# EAGLE design psplcd (EAGLE 5.11)

## Sheet 1 of 2
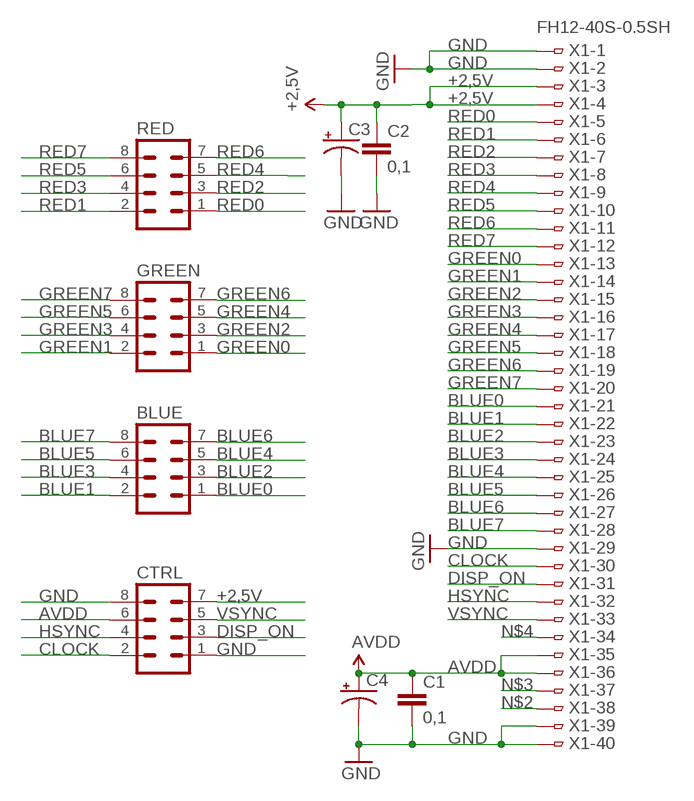
[diagram p0: schematic, sheet 1]

### Parts
BLUE  MA04-2  [MA04-2]
C1  0,1  CAP0603-CAP  [0603-CAP]
C2  0,1  CAP0603-CAP  [0603-CAP]
C3  CAP_POL3528  [EIA3528]
C4  CAP_POL3528  [EIA3528]
CTRL  MA04-2  [MA04-2]
GREEN  MA04-2  [MA04-2]
RED  MA04-2  [MA04-2]
X1  FH12-40S-0.5SH  [FH12-40S-0.5SH]

### Nets
+2,5V: C2.1 C3.A(+) CTRL.7 X1.3 X1.4
AVDD: C1.1 C4.A(+) CTRL.6 X1.35 X1.36
BLUE0: BLUE.1 X1.21
BLUE1: BLUE.2 X1.22
BLUE2: BLUE.3 X1.23
BLUE3: BLUE.4 X1.24
BLUE4: BLUE.5 X1.25
BLUE5: BLUE.6 X1.26
BLUE6: BLUE.7 X1.27
BLUE7: BLUE.8 X1.28
CLOCK: CTRL.2 X1.30
DISP_ON: CTRL.3 X1.31
GND: C1.2 C2.2 C3.C(-) C4.C(-) CTRL.1 CTRL.8 X1.1 X1.2 X1.29 X1.39 X1.40 ; also sheet 2
GREEN0: GREEN.1 X1.13
GREEN1: GREEN.2 X1.14
GREEN2: GREEN.3 X1.15
GREEN3: GREEN.4 X1.16
GREEN4: GREEN.5 X1.17
GREEN5: GREEN.6 X1.18
GREEN6: GREEN.7 X1.19
GREEN7: GREEN.8 X1.20
HSYNC: CTRL.4 X1.32
N$2: X1.38
N$3: X1.37
N$4: X1.34
RED0: RED.1 X1.5
RED1: RED.2 X1.6
RED2: RED.3 X1.7
RED3: RED.4 X1.8
RED4: RED.5 X1.9
RED5: RED.6 X1.10
RED6: RED.7 X1.11
RED7: RED.8 X1.12
VSYNC: CTRL.5 X1.33

## Sheet 2 of 2
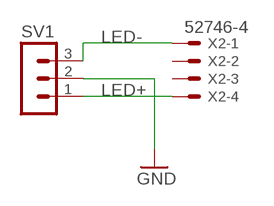
[diagram p1: schematic, sheet 2]

### Parts
SV1  MA03-1  [MA03-1]
X2  52746-4  [52746-4]

### Nets
GND: SV1.2 ; also sheet 1
LED+: SV1.1 X2.4
LED-: SV1.3 X2.1
Unconnected: X2.2 X2.3

## Library data of the parts
BLUE CTRL GREEN RED = con-lstb:MA04-2: PIN HEADER; OC_FARNELL: unknown; OC_NEWARK: unknown
C1 C2 = SparkFun:CAP: Capacitor Standard 0603 ceramic capacitor, and 0.1" leaded capacitor.
C3 C4 = SparkFun:CAP_POL: Capacitor Polarized These are standard SMD and PTH capacitors. Normally 10uF, 47uF, and 100uF in electrolytic and tantalum varieties. Always verify the external diameter of the through hole cap, it varies with capacity, voltage, and manufacturer. The EIA devices should be standard.
SV1 = con-lstb:MA03-1: PIN HEADER; OC_FARNELL: unknown; OC_NEWARK: unknown
X1 = con-hirose:FH12-40S-0.5S: 0.5mm Pitch Connectors For FPC/FFC Source: Data sheet <http://www.hirose.co.jp/cataloge_hp/e58605370.pdf>; MPN: FH12-40S-0.5SH(55); OC_FARNELL: 1324556; OC_NEWARK: 34M6178
X2 = con-molex:52746-4: FPC Connector ZIF for SMT 0.5mm Source: http://www.farnell.com/datasheets/73044.pdf [DWG. NO. (Sheet 1 OF 2) SD-52746-**17]; MPN: 52746-442; OC_FARNELL: unknown; OC_NEWARK: 55R0391

## Board
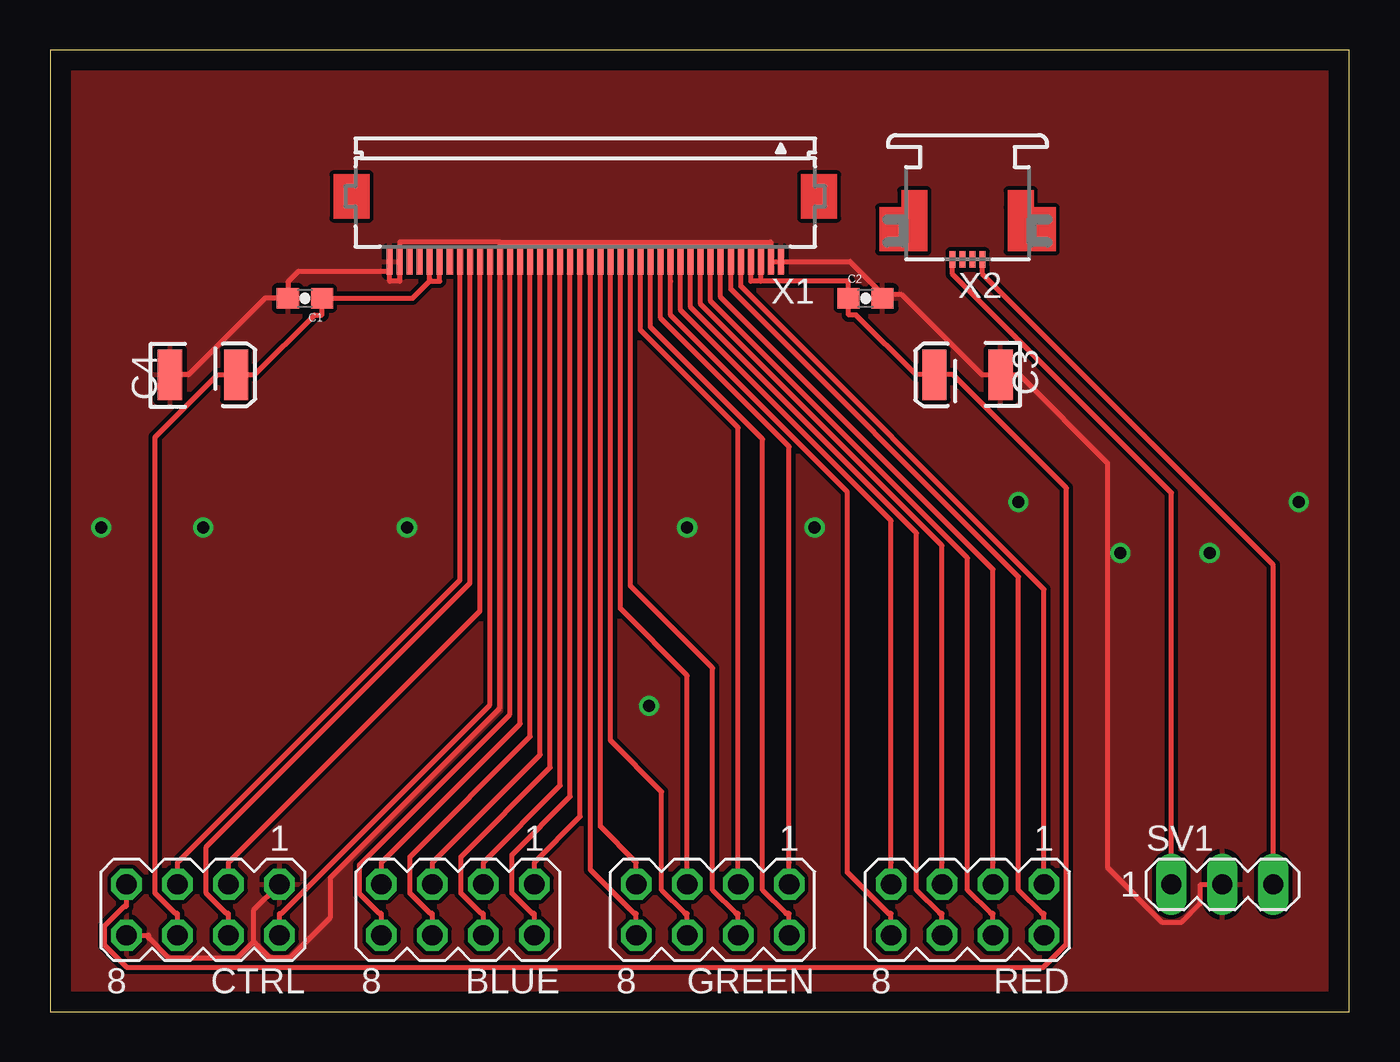
[diagram p2: board, top side]
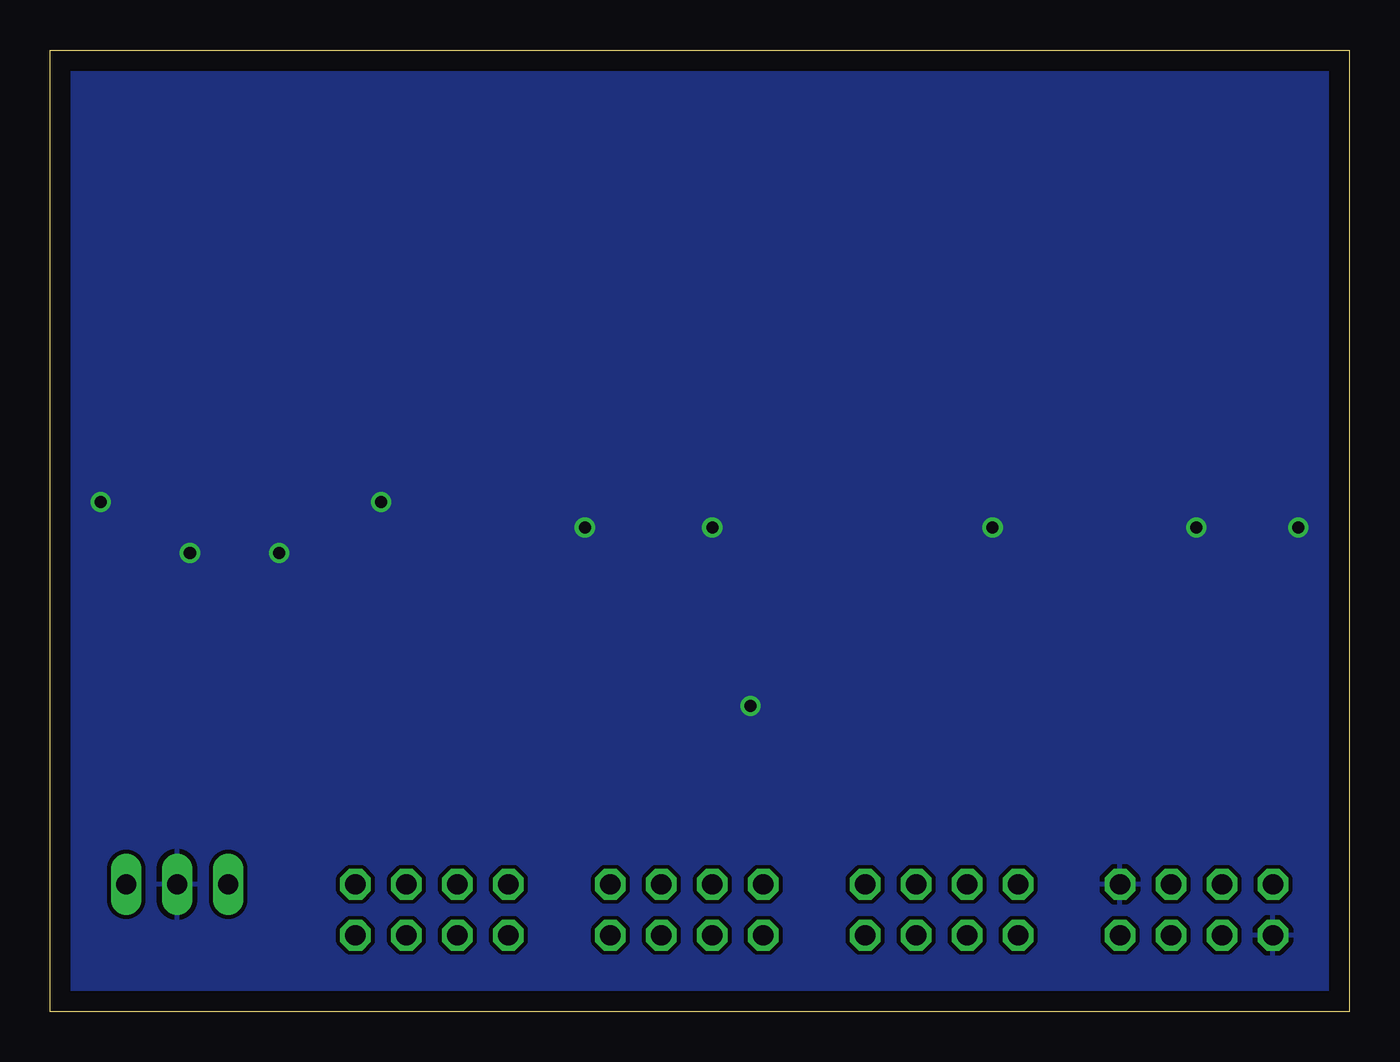
[diagram p3: board, bottom side, seen from below]

Size 64.75 x 47.93 mm. Coordinates in mm from the lower left corner, seen from the top.
Outline: 0,0 64.75,0 64.75,47.93 0,47.93 0,0
Copper layers (1*16): Top 0.035mm / dielectric 1.5mm / Bottom 0.035mm
Design rules "default": minimum track width 10mil, minimum drill 24mil, track to track 8mil, track to pad 8mil, pad to pad 8mil, via to via 8mil, smd to smd 8mil, copper to edge 40mil, drill to drill 8mil, minimum pad ring 10mil, minimum via ring 8mil, stop-mask expansion 4mil, vias tented up to drill 0mil, thermal gap 10mil

### Footprints (pad centres in the part's own frame; a part is rotated, then mirrored left to right if it is on the bottom)
MA04-2 = drill 1.016 octagon: 1 -3.81,-1.27; 2 -3.81,1.27; 3 -1.27,-1.27; 4 -1.27,1.27; 5 1.27,-1.27; 6 1.27,1.27; 7 3.81,-1.27; 8 3.81,1.27
0603-CAP = smd 1.1 x 1: 1 -0.85,0; 2 0.85,0
EIA3528 = smd 1.2 x 2.5: A 1.65,0; C -1.65,0
MA03-1 = drill 1.016 long: 1 -2.54,0; 2 0,0; 3 2.54,0
FH12-40S-0.5SH = smd 0.3 x 1.3: 1 -9.75,3.25; 2 -9.25,3.25; 3 -8.75,3.25; 4 -8.25,3.25; 5 -7.75,3.25; 6 -7.25,3.25; 7 -6.75,3.25; 8 -6.25,3.25; 9 -5.75,3.25; 10 -5.25,3.25; 11 -4.75,3.25; 12 -4.25,3.25; 13 -3.75,3.25; 14 -3.25,3.25; 15 -2.75,3.25; 16 -2.25,3.25; 17 -1.75,3.25; 18 -1.25,3.25; 19 -0.75,3.25; 20 -0.25,3.25; 21 0.25,3.25; 22 0.75,3.25; 23 1.25,3.25; 24 1.75,3.25; 25 2.25,3.25; 26 2.75,3.25; 27 3.25,3.25; 28 3.75,3.25; 29 4.25,3.25; 30 4.75,3.25; 31 5.25,3.25; 32 5.75,3.25; 33 6.25,3.25; 34 6.75,3.25; 35 7.25,3.25; 36 7.75,3.25; 37 8.25,3.25; 38 8.75,3.25; 39 9.25,3.25; 40 9.75,3.25
52746-4 = smd 0.3 x 0.8: 1 -0.75,0.6; 2 -0.25,0.6; 3 0.25,0.6; 4 0.75,0.6

### Placement (x,y rotation side)
BLUE  20.32,5.08 180 top
C1  12.7,35.56 180 top
C2  40.64,35.56 0 top
C3  45.72,31.75 180 top
C4  7.62,31.75 0 top
CTRL  7.62,5.08 180 top
GREEN  33.02,5.08 180 top
RED  45.72,5.08 180 top
SV1  58.42,6.35 0 top
X1  26.67,40.64 180 top
X2  45.72,38.1 180 top

### Tracks (layer width: path | path; a pad name or v marks a point on that pad's centre or on a via)
+2,5V
  Top 0.254: 35.42,36.41 | 35.42,36.41 39.77,36.41 39.79,36.39 C2.1 39.79,34.73 40.16,34.73 43.14,31.75 C3.A 45,31.75 50.66,26.09 50.66,3.36 49.5,2.2 3.82,2.2 2.72,3.31 2.72,4.28 3.7,5.26 3.81,5.26 CTRL.7 | 35.42,36.41 35.42,36.52 X1.3 | 35.42,36.41 34.92,36.41 X1.4
AVDD
  Top 0.254: 18.92,36.41 18.07,35.56 C1.1 13.55,34.73 13.18,34.73 10.2,31.75 C4.A 8.34,31.75 5.22,28.63 5.22,5.91 6.23,4.9 6.35,4.9 CTRL.6 | X1.36 18.92,36.52 18.92,36.41 | 18.92,36.41 | X1.35 19.42,36.41 18.92,36.41
BLUE0
  Top 0.254: BLUE.1 24.13,7.44 26.42,9.73 X1.21
BLUE1
  Top 0.254: BLUE.2 24.13,4.9 24.02,4.9 23.02,5.9 23.02,7.83 25.92,10.73 X1.22
BLUE2
  Top 0.254: BLUE.3 21.59,7.44 25.42,11.27 X1.23
BLUE3
  Top 0.254: BLUE.4 21.59,4.9 21.48,4.9 20.48,5.9 20.48,7.73 24.92,12.17 X1.24
BLUE4
  Top 0.254: BLUE.5 19.05,7.44 24.42,12.81 X1.25
BLUE5
  Top 0.254: BLUE.6 19.05,4.9 18.94,4.9 17.94,5.9 17.94,7.73 23.92,13.71 X1.26
BLUE6
  Top 0.254: BLUE.7 16.51,7.44 23.42,14.35 X1.27
BLUE7
  Top 0.254: BLUE.8 16.51,4.9 16.4,4.9 15.41,5.89 15.41,7.31 22.92,14.82 X1.28
CLOCK
  Top 0.254: X1.30 21.92,15.29 11.53,4.9 11.43,4.9 CTRL.2
DISP_ON
  Top 0.254: CTRL.3 8.89,7.44 21.42,19.97 X1.31
GND  (via drill 0.6)
  Top 0.254: 16.92,36.9 12.36,36.9 11.85,36.39 C1.2 10.71,35.56 6.9,31.75 C4.C | 16.92,36.9 16.92,36.41 17.42,36.41 X1.39 17.42,38.37 22.42,38.37 | 16.92,36.9 X1.40 | 41.49,35.77 39.87,37.39 X1.1 X1.2 35.92,38.37 22.42,38.37 | 22.42,38.37 22.42,38.26 X1.29 22.42,15.15 13.97,6.7 13.97,4.71 11.98,2.72 10.91,2.72 10.15,3.48 | SV1.2 57.33,6.35 57.33,5.39 56.4,4.46 55.41,4.46 52.69,7.19 52.69,27.36 48.3,31.75 C3.C 46.44,31.75 42.42,35.77 41.49,35.77 | 41.49,35.77 C2.2 | 10.15,3.48 10.15,5.07 CTRL.1 | 10.15,3.48 9.35,2.68 5.89,2.68 4.9,3.67 4.9,3.81 CTRL.8
  other vias: 17.78,24.13 31.75,24.13 48.26,25.4 62.23,25.4 2.54,24.13 29.84,15.24 38.1,24.13 53.34,22.86 7.62,24.13 57.78,22.86
  pour Top: 0,0 0,48.26 64.77,48.26 64.77,0
  pour Bottom: 0,48.26 0,0 64.77,0 64.77,48.26
GREEN0
  Top 0.254: X1.13 30.42,34.58 36.83,28.16 36.83,7.44 GREEN.1
GREEN1
  Top 0.254: X1.14 29.92,36.41 29.92,34.13 35.51,28.54 35.51,6.06 36.66,4.9 36.83,4.9 GREEN.2
GREEN2
  Top 0.254: X1.15 29.42,33.98 34.29,29.11 GREEN.3
GREEN3
  Top 0.254: X1.16 28.92,21.22 33.02,17.12 33.02,6.06 34.18,4.9 34.29,4.9 GREEN.4
GREEN4
  Top 0.254: X1.17 28.42,20.09 31.75,16.76 GREEN.5
GREEN5
  Top 0.254: GREEN.6 31.75,4.9 31.64,4.9 30.48,6.06 30.48,10.97 27.92,13.53 X1.18
GREEN6
  Top 0.254: GREEN.7 29.21,7.44 27.42,9.23 X1.19
GREEN7
  Top 0.254: GREEN.8 29.21,4.9 29.1,4.9 26.92,7.08 X1.20
HSYNC
  Top 0.254: X1.32 20.92,21.36 7.78,8.22 7.78,5.9 8.78,4.9 8.89,4.9 CTRL.4
LED+
  Top 0.254: X2.4 44.97,36.77 55.88,25.86 SV1.1
LED-
  Top 0.254: X2.1 46.47,36.77 60.96,22.28 SV1.3
RED0
  Top 0.254: RED.1 49.53,21.05 34.42,36.16 X1.5
RED1
  Top 0.254: RED.2 49.53,4.9 49.42,4.9 48.26,6.06 48.26,21.67 33.92,36.01 X1.6
RED2
  Top 0.254: X1.7 33.42,35.62 46.99,22.05 46.99,7.44 RED.3
RED3
  Top 0.254: X1.8 32.92,35.41 45.72,22.61 45.72,6.06 46.88,4.9 46.99,4.9 RED.4
RED4
  Top 0.254: X1.9 32.42,35.26 44.45,23.23 44.45,7.44 RED.5
RED5
  Top 0.254: X1.10 31.92,35.12 43.18,23.86 43.18,6.06 44.34,4.9 44.45,4.9 RED.6
RED6
  Top 0.254: X1.11 31.42,34.97 41.91,24.48 41.91,7.44 RED.7
RED7
  Top 0.254: RED.8 41.91,4.9 41.77,4.9 39.74,6.94 39.74,25.91 30.92,34.72 30.92,36.41 X1.12
VSYNC
  Top 0.254: X1.33 20.42,21.51 6.35,7.44 CTRL.5